# EAGLE design ARM-LPC1115_V0.09 (EAGLE 6.4)
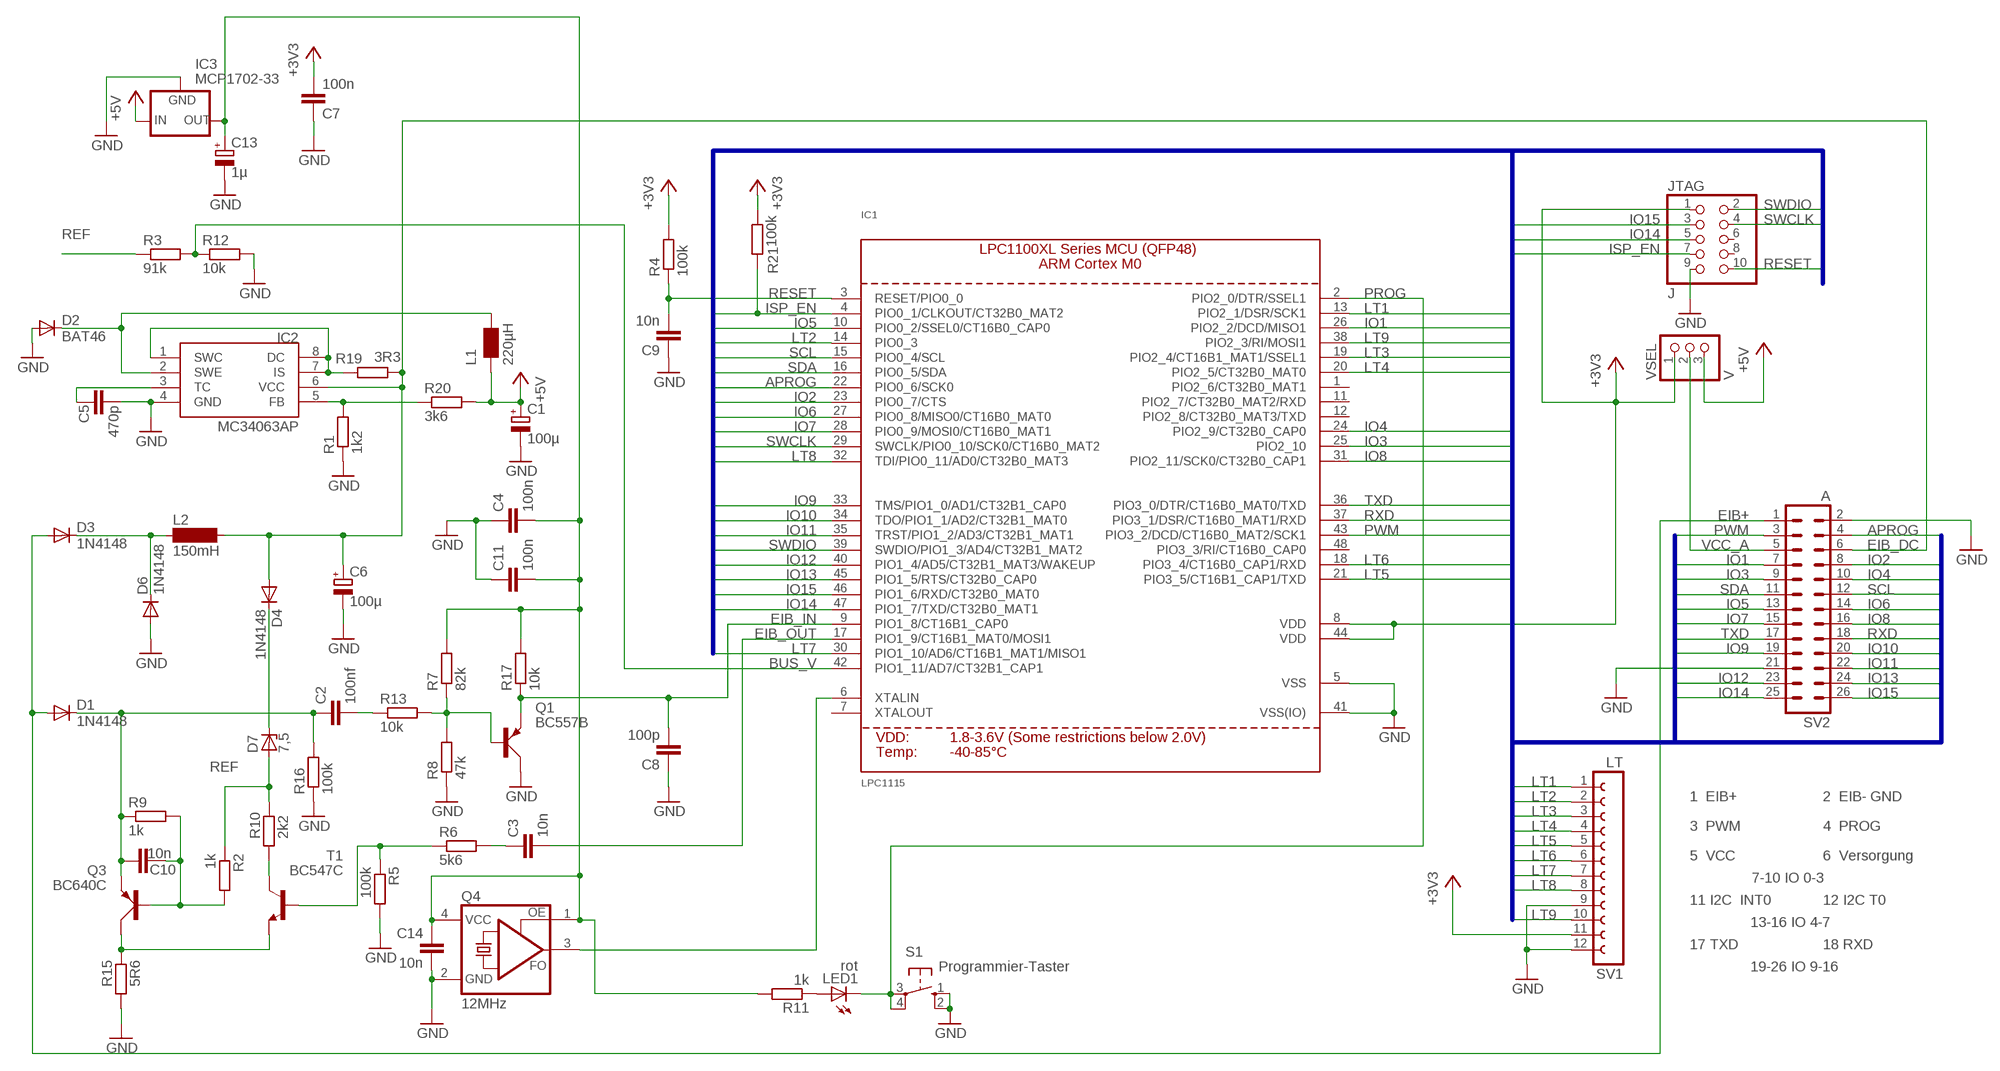
[diagram p0: schematic, sheet 1]

## Parts
C1  100µ  CPOL-EUE5-8.5  [E5-8,5]
C2  100nf  C-EU050-024X044  [C050-024X044]
C3  10n  C-EU050-024X044  [C050-024X044]
C4  100n  C-EU025-024X044  [C025-024X044]
C5  470p  C-EU025-024X044  [C025-024X044]
C6  100µ  CPOL-EUE5-8.5  [E5-8,5]
C7  100n  C-EU050-024X044  [C050-024X044]
C8  100p  C-EU050-024X044  [C050-024X044]
C9  10n  C-EU050-024X044  [C050-024X044]
C10  10n  C-EU050-024X044  [C050-024X044]
C11  100n  C-EU025-024X044  [C025-024X044]
C13  1µ  CPOL-EUE2-4  [E2-4]
C14  10n  C-EUC1206  [C1206]
D1  1N4148  DIODE-D-5  [D-5]
D2  BAT46  DIODE-C1702-05  [C1702-05]
D3  1N4148  DIODE-D-2.5  [D-2.5]
D4  1N4148  DIODE-D-5  [D-5]
D6  1N4148  DIODE-D-2.5  [D-2.5]
D7  7,5  ZENER-DIODEZD-7.5  [ZDIO-7.5]
IC1  LPC1115  LPC1113/4/5_QFP48_XLSERIES  [LQFP48]
IC2  MC34063AP  [DIL08]
IC3  MCP1702-33  79LXX  [79LXX]
JTAG  J  PINHD-2X05_2.00  [2X05M]
L1  220µH  L_R85  [L_RAD_D8RM5]
L2  150mH  SD12-1000  [SD12_1000]
LED1  rot  LED3MM  [LED3MM]
Q1  BC557B  BC557  [SOT54A]
Q3  BC640C  BC640  [SOT54D]
Q4  12MHz  ASFL  [ASF]
R1  1k2  R-EU_0207/10  [0207/10]
R2  1k  R-EU_0204/7  [0204/7]
R3  91k  R-EU_0204/7  [0204/7]
R4  100k  R-EU_0204/7  [0204/7]
R5  100k  R-EU_0207/10  [0207/10]
R6  5k6  R-EU_0204/7  [0204/7]
R7  82k  R-EU_0207/7  [0207/7]
R8  47k  R-EU_0207/7  [0207/7]
R9  1k  R-EU_0204/7  [0204/7]
R10  2k2  R-EU_0204/7  [0204/7]
R11  1k  R-EU_0207/7  [0207/7]
R12  10k  R-EU_0204/7  [0204/7]
R13  10k  R-EU_0207/7  [0207/7]
R15  5R6  R-EU_0207/10  [0207/10]
R16  100k  R-EU_0207/7  [0207/7]
R17  10k  R-EU_0207/7  [0207/7]
R19  3R3  R-EU_0207/10  [0207/10]
R20  3k6  R-EU_0207/10  [0207/10]
R21  100k  R-EU_0204/7  [0204/7]
S1  Programmier-Taster  10-XX  [B3F-10XX]
SV1  LT  FE12-1  [FE12]
SV2  A  ML26  [ML26]
T1  BC547C  BC547  [TO92]
VSEL  V  HEADER-1X3ROUND  [1X03_ROUND]

## Nets
APROG: IC1.22(PIO0_6/SCK0) SV2.4
BUS_V: IC1.42(PIO1_11/AD7/CT32B1_CAP1) R3.2 R12.1
DRAIN: C2.1 C10.1 D1.C Q3.E R9.1 R16.2
EIB+: D1.A D3.A SV2.1
EIB_DC: C6.+ D4.A IC2.6(VCC) L2.2 R19.2 SV2.6
EIB_IN: C8.2 IC1.9(PIO1_8/CT16B1_CAP0) Q1.E R17.1
EIB_OUT: C3.2 IC1.17(PIO1_9/CT16B1_MAT0/MOSI1)
GND: C1.- C4.1 C5.2 C6.- C7.1 C8.1 C9.1 C11.1 C13.- C14.2 D2.A D6.A IC1.5(VSS) IC1.41(VSS(IO)) IC2.4(GND) IC3.GND JTAG.9 Q1.C Q4.2(GND) R1.1 R5.2 R8.1 R12.2 R15.1 R16.1 S1.1(S) S1.2(S1) SV1.9 SV1.12 SV2.2 SV2.21
IO1: IC1.26(PIO2_2/DCD/MISO1) SV2.7
IO2: IC1.23(PIO0_7/CTS) SV2.8
IO3: IC1.25(PIO2_10) SV2.9
IO4: IC1.24(PIO2_9/CT32B0_CAP0) SV2.10
IO5: IC1.10(PIO0_2/SSEL0/CT16B0_CAP0) SV2.13
IO6: IC1.27(PIO0_8/MISO0/CT16B0_MAT0) SV2.14
IO7: IC1.28(PIO0_9/MOSI0/CT16B0_MAT1) SV2.15
IO8: IC1.31(PIO2_11/SCK0/CT32B0_CAP1) SV2.16
IO9: IC1.33(TMS/PIO1_0/AD1/CT32B1_CAP0) SV2.19
IO10: IC1.34(TDO/PIO1_1/AD2/CT32B1_MAT0) SV2.20
IO11: IC1.35(TRST/PIO1_2/AD3/CT32B1_MAT1) SV2.22
IO12: IC1.40(PIO1_4/AD5/CT32B1_MAT3/WAKEUP) SV2.23
IO13: IC1.45(PIO1_5/RTS/CT32B0_CAP0) SV2.24
IO14: IC1.47(PIO1_7/TXD/CT32B0_MAT1) JTAG.5 SV2.25
IO15: IC1.46(PIO1_6/RXD/CT32B0_MAT0) JTAG.3 SV2.26
ISP_EN: IC1.4(PIO0_1/CLKOUT/CT32B0_MAT2) JTAG.7 R21.1
LT1: IC1.13(PIO2_1/DSR/SCK1) SV1.1
LT2: IC1.14(PIO0_3) SV1.2
LT3: IC1.19(PIO2_4/CT16B1_MAT1/SSEL1) SV1.3
LT4: IC1.20(PIO2_5/CT32B0_MAT0) SV1.4
LT5: IC1.21(PIO3_5/CT16B1_CAP1/TXD) SV1.5
LT6: IC1.18(PIO3_4/CT16B0_CAP1/RXD) SV1.6
LT7: IC1.30(PIO1_10/AD6/CT16B1_MAT1/MISO1) SV1.7
LT8: IC1.32(TDI/PIO0_11/AD0/CT32B0_MAT3) SV1.8
LT9: IC1.38(PIO2_3/RI/MOSI1) SV1.10
N$1: C3.1 R6.2
N$2: C2.2 R13.1
N$3: IC2.5(FB) R1.2 R20.1
N$4: IC2.1(SWC) IC2.7(IS) IC2.8(DC) R19.1
N$6: R10.1 T1.3(C)
N$7: Q3.C R15.2 T1.1(E)
N$8: D3.C D6.C L2.1
N$9: D4.C D7.C
N$10: D2.C IC2.2(SWE) L1.1
N$12: R5.1 R6.1 T1.2(B)
N$13: C5.1 IC2.3(TC)
N$14: Q1.B R7.1 R8.2 R13.2
N$15: C10.2 Q3.B R2.2 R9.2
N$17: IC1.6(XTALIN) Q4.3(FO)
N$41: LED1.A R11.1
PROG: IC1.2(PIO2_0/DTR/SSEL1) LED1.K(C) S1.3(P) S1.4(P1)
PWM: IC1.43(PIO3_2/DCD/CT16B0_MAT2/SCK1) SV2.3
REF: D7.A R2.1 R3.1 R10.2
RESET: C9.2 IC1.3(RESET/PIO0_0) JTAG.10 R4.1
RXD: IC1.37(PIO3_1/DSR/CT16B0_MAT1/RXD) SV2.18
SCL: IC1.15(PIO0_4/SCL) SV2.12
SDA: IC1.16(PIO0_5/SDA) SV2.11
SWCLK: IC1.29(SWCLK/PIO0_10/SCK0/CT16B0_MAT2) JTAG.4
SWDIO: IC1.39(SWDIO/PIO1_3/AD4/CT32B1_MAT2) JTAG.2
TXD: IC1.36(PIO3_0/DTR/CT16B0_MAT0/TXD) SV2.17
VCC_3V3: C4.2 C7.2 C11.2 C13.+ C14.1 IC1.8(VDD) IC1.44(VDD) IC3.OUT JTAG.1 Q4.1(OE) Q4.4(VCC) R4.2 R7.2 R11.2 R17.2 R21.2 SV1.11 VSEL.1 ; supply symbol labelled +3V3
VCC_5V: C1.+ IC3.IN L1.2 R20.2 VSEL.3 ; supply symbol labelled +5V
VCC_A: SV2.5 VSEL.2
Unconnected: IC1.1(PIO2_6/CT32B0_MAT1) IC1.7(XTALOUT) IC1.11(PIO2_7/CT32B0_MAT2/RXD) IC1.12(PIO2_8/CT32B0_MAT3/TXD) IC1.48(PIO3_3/RI/CT16B0_CAP0) JTAG.6 JTAG.8

## Buses
IO[1..15],LT[1..9],SCL,SDA,PWM,APROG,RXD,TXD,RESET,SWCLK,SWDIO,ISP_EN

## Notes on the sheet
- 1  EIB+ | 2  EIB- GND
- 3  PWM | 4  PROG
- 5  VCC | 6  Versorgung
- 7-10 IO 0-3
- 11 I2C  INT0 | 12 I2C T0
- 13-16 IO 4-7
- 17 TXD | 18 RXD
- 19-26 IO 9-16

## Library data of the parts
C1 C6 C13 = rcl:CPOL-EU: POLARIZED CAPACITOR, European symbol
C2-C5 C7-C11 C14 = rcl:C-EU: CAPACITOR, European symbol
D1-D4 D6 = diode:DIODE-: DIODE
D7 = diode:ZENER-DIODE: Z-Diode
IC1 = microbuilder:LPC1113/4/5_QFP48_XLSERIES: LPC1113/4/5 ARM Cortex M0 MCU (50MHz) - XL Series (FBD48/3x3) LPC1115FBD48/303: Max Frequency: 50MHz Flash: 64kB SRAM: 8kB ADC: 10-bit
IC2 = mc34063:MC34063
IC3 = v-reg:79LXX: VOLTAGE REGULATOR
JTAG = pinhead-2:PINHD-2X05: PIN HEADER
L1 = fbctrls1:L
L2 = inductor-neosid:SD12: INDUCTOR nominal inductance
LED1 = led:LED: LED OSRAM: - CHIPLED LG R971, LG N971, LY N971, LG Q971, LY Q971, LO R971, LY R971 LH N974, LH R974 LS Q976, LO Q976, LY Q976 LO Q996 - Hyper CHIPLED LW Q18S LB Q993, LB Q99A, LB R99A - SideLED LS A670, LO A670, LY A670, LG A670, LP A670 LB A673, LV A673, LT A673, LW A673 LH A674 LY A675 LS A676, LA A676, LO A676, LY A676, LW A676 LS A679, LY A679, LG A679 - Hyper Micro SIDELED® LS Y876, LA Y876, LO Y876, LY Y876 LT Y87S - SmartLED LW L88C, LW L88S LB L89C, LB L89S, LG L890 LS L89K, LO L89K, LY L89K LS L896, LA L896, LO L896, LY L896 - TOPLED LS T670, LO T670, LY T670, LG T670, LP T670 LSG T670, LSP T670, LSY T670, LOP T670, LYG T670 LG T671, LOG T671, LSG T671 LB T673, LV T673, LT T673, LW T673 LH T674 LS T676, LA T676, LO T676, LY T676, LB T676, LH T676, LSB T676, LW T676 LB T67C, LV T67C, LT T67C, LS T67K, LO T67K, LY T67K, LW E67C LS E67B, LA E67B, LO E67B, LY E67B, LB E67C, LV E67C, LT E67C LW T67C LS T679, LY T679, LG T679 LS T770, LO T770, LY T770, LG T770, LP T770 LB T773, LV T773, LT T773, LW T773 LH T774 LS E675, LA E675, LY E675, LS T675 LS T776, LA T776, LO T776, LY T776, LB T776 LHGB T686 LT T68C, LB T68C - Hyper Mini TOPLED® LB M676 - Mini TOPLED Santana® LG M470 LS M47K, LO M47K, LY M47K Source: http://www.osram.convergy.de - LUMILED® LXK2-PW12-R00, LXK2-PW12-S00, LXK2-PW14-U00, LXK2-PW14-V00 LXK2-PM12-R00, LXK2-PM12-S00, LXK2-PM14-U00 LXK2-PE12-Q00, LXK2-PE12-R00, LXK2-PE12-S00, LXK2-PE14-T00, LXK2-PE14-U00 LXK2-PB12-K00, LXK2-PB12-L00, LXK2-PB12-M00, LXK2-PB14-N00, LXK2-PB14-P00, LXK2-PB14-Q00 LXK2-PR12-L00, LXK2-PR12-M00, LXK2-PR14-Q00, LXK2-PR14-R00 LXK2-PD12-Q00, LXK2-PD12-R00, LXK2-PD12-S00 LXK2-PH12-R00, LXK2-PH12-S00 LXK2-PL12-P00, LXK2-PL12-Q00, LXK2-PL12-R00 Source: www.luxeon.com
Q1 = transistor-small-signal:BC557: PNP TRANSISTOR
Q3 = transistor-small-signal:BC640: PNP TRANSISTOR
Q4 = crystal:ASF*: CRYSTAL CLOCK OSCILLATORS 5.0 Vdc or 3.3 Vdc - LOW PROFILE ULTRA MINIATURE CERAMIC SURFACE MOUNT Source: http://www.abracon.com/Oscillators/asf1-L-L1.pdf
R1-R13 R15-R17 R19-R21 = rcl:R-EU_: RESISTOR, European symbol
S1 = switch-omron:10-XX: OMRON SWITCH
SV1 = con-lsta:FE12-1: FEMALE HEADER; OC_FARNELL: unknown; OC_NEWARK: unknown
SV2 = con-harting-ml:ML26: HARTING; OC_FARNELL: unknown; OC_NEWARK: unknown
T1 = transistor:BC547: NPN TRANSISTOR
VSEL = microbuilder:HEADER-1X3: PIN HEADER

## Board
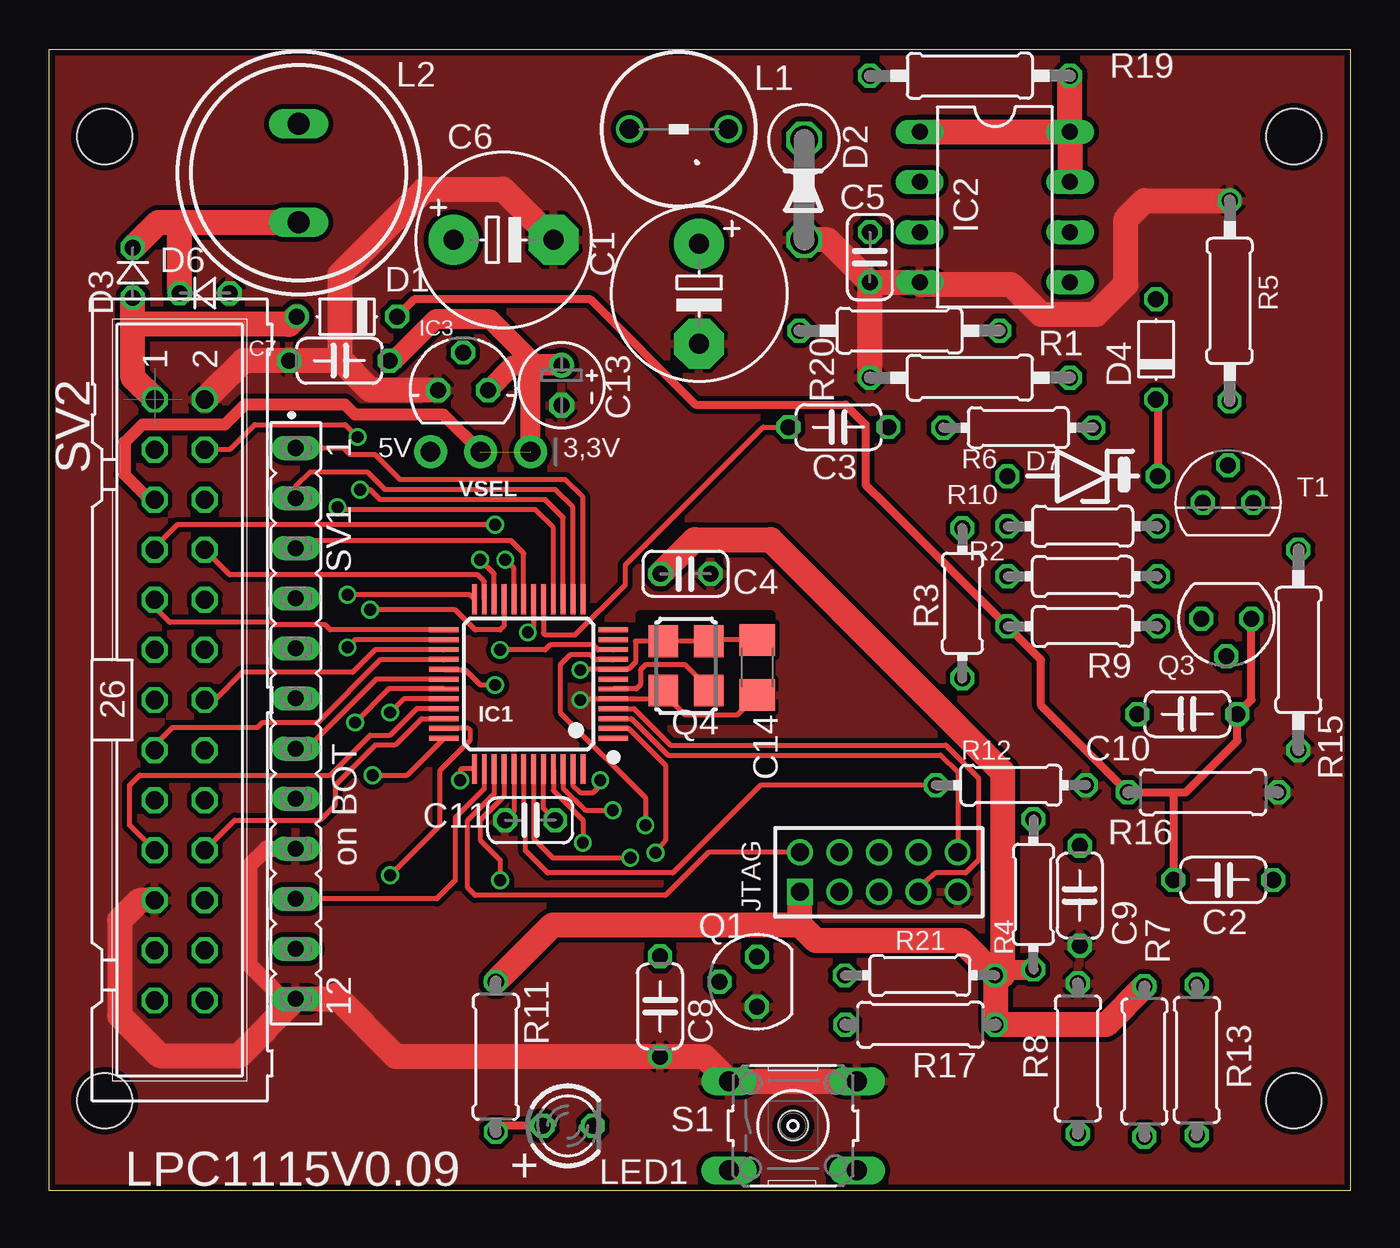
[diagram p1: board, top side]
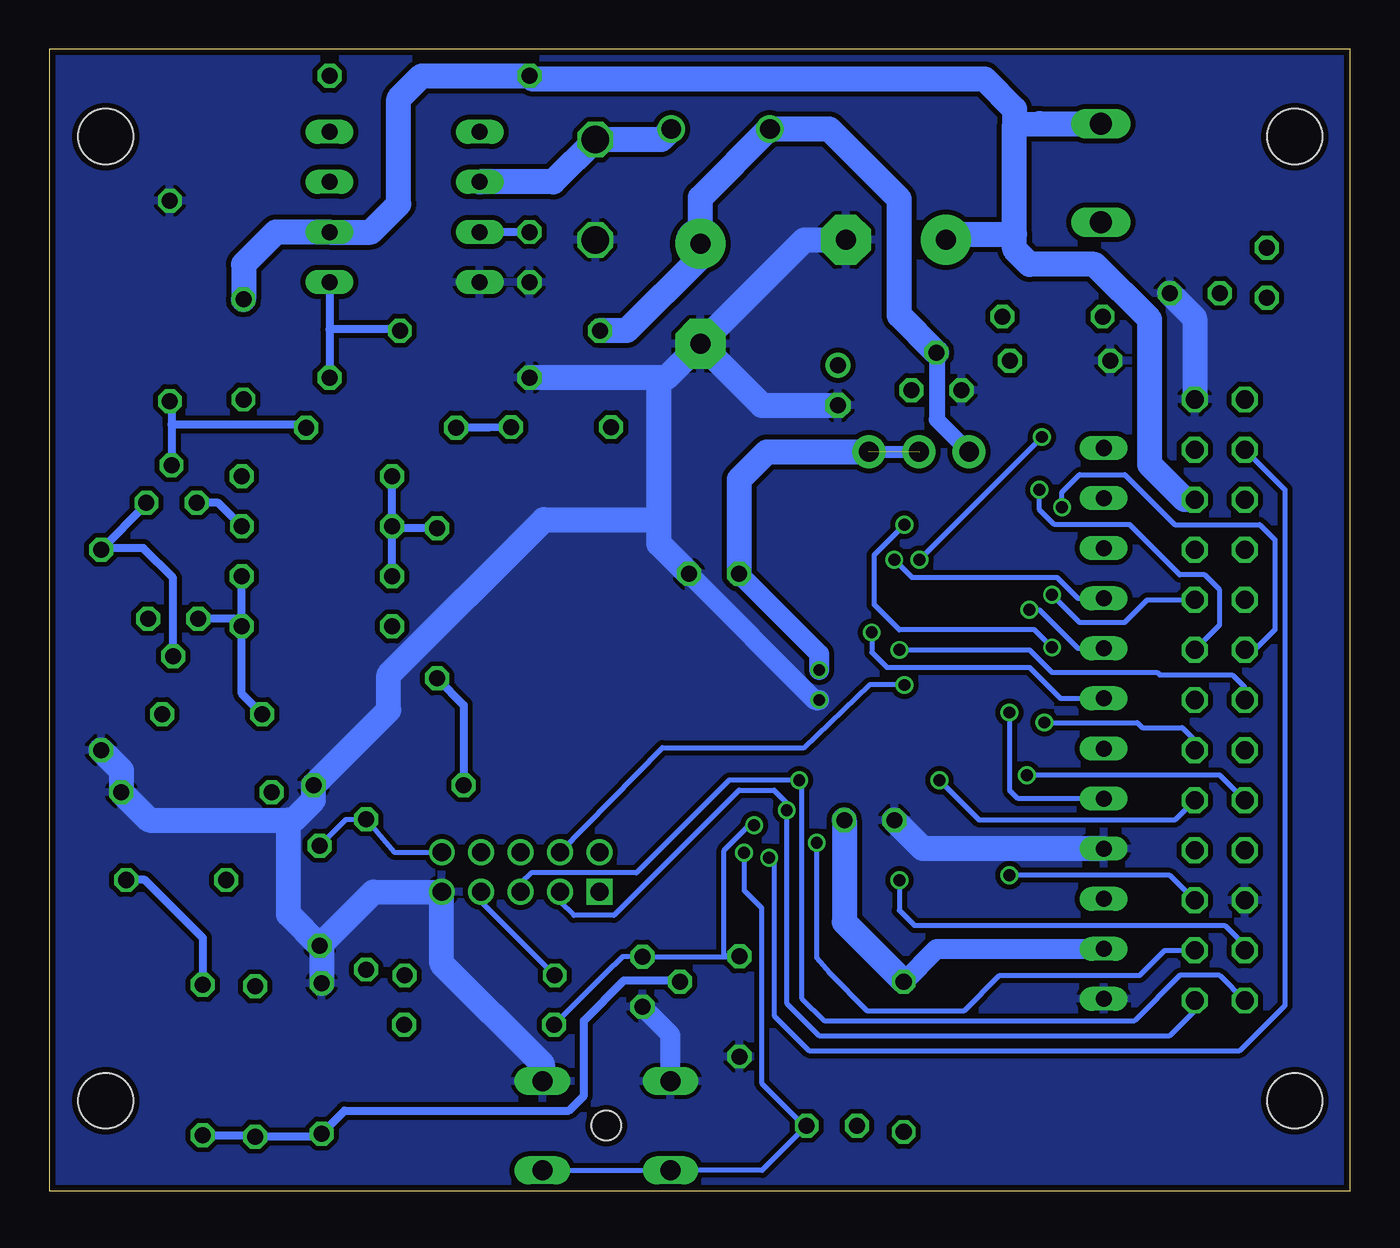
[diagram p2: board, bottom side, seen from below]

Size 66 x 57.9 mm. Coordinates in mm from the lower left corner, seen from the top.
Outline: 0,57.9 66,57.9 66,0 0,0 0,57.9
Copper layers (1*16): Top 0.035mm / dielectric 1.5mm / Bottom 0.035mm
Design rules "PCB-POOL Standard *": minimum track width 0.15mm, minimum drill 0.3mm, track to track 0.15mm, track to pad 0.15mm, pad to pad 0.15mm, via to via 0.15mm, smd to smd 0.15mm, copper to edge 0.3mm, drill to drill 0.2mm, minimum pad ring 0.2mm, minimum via ring 0.15mm, stop-mask expansion 0.075mm, vias tented up to drill 0mil, thermal gap 0.2mm
Holes 2.8 mm at 2.81,53.48 63.14,53.48 63.14,4.58 2.81,4.58
Holes 1.5 mm at 37.73,3.31
tRestrict: area 30,23.9 to 36.6,29.2

### Footprints (pad centres in the part's own frame; a part is rotated, then mirrored left to right if it is on the bottom)
E5-8,5 = drill 1.016 pad 2.54: + -2.54,0 | drill 1.016 pad 2.54 octagon: - 2.54,0
C050-024X044 = drill 0.813 octagon: 1 -2.54,0; 2 2.54,0
C025-024X044 = drill 0.813 octagon: 1 -1.27,0; 2 1.27,0
E2-4 = drill 0.813 pad 1.27: + -1.016,0 | drill 0.813 pad 1.27 octagon: - 1.016,0
C1206 = smd 1.6 x 1.8: 1 -1.4,0; 2 1.4,0
D-5 = drill 0.813 octagon: A 2.54,0; C -2.54,0
C1702-05 = drill 1.397 octagon: A 2.54,0; C -2.54,0
D-2.5 = drill 0.813 octagon: A 1.27,0; C -1.27,0
ZDIO-7.5 = drill 0.813 octagon: A 3.81,0; C -3.81,0
LQFP48 = smd 1.5 x 0.25: 1 -4.3,2.75; 2 -4.3,2.25; 3 -4.3,1.75; 4 -4.3,1.25; 5 -4.3,0.75; 6 -4.3,0.25; 7 -4.3,-0.25; 8 -4.3,-0.75; 9 -4.3,-1.25; 10 -4.3,-1.75; 11 -4.3,-2.25; 12 -4.3,-2.75; 25 4.3,-2.75; 26 4.3,-2.25; 27 4.3,-1.75; 28 4.3,-1.25; 29 4.3,-0.75; 30 4.3,-0.25; 31 4.3,0.25; 32 4.3,0.75; 33 4.3,1.25; 34 4.3,1.75; 35 4.3,2.25; 36 4.3,2.75 | smd 0.25 x 1.5: 13 -2.75,-4.3; 14 -2.25,-4.3; 15 -1.75,-4.3; 16 -1.25,-4.3; 17 -0.75,-4.3; 18 -0.25,-4.3; 19 0.25,-4.3; 20 0.75,-4.3; 21 1.25,-4.3; 22 1.75,-4.3; 23 2.25,-4.3; 24 2.75,-4.3; 37 2.75,4.3; 38 2.25,4.3; 39 1.75,4.3; 40 1.25,4.3; 41 0.75,4.3; 42 0.25,4.3; 43 -0.25,4.3; 44 -0.75,4.3; 45 -1.25,4.3; 46 -1.75,4.3; 47 -2.25,4.3; 48 -2.75,4.3
DIL08 = drill 0.813 long: 1 -3.81,-3.81; 2 -1.27,-3.81; 3 1.27,-3.81; 4 3.81,-3.81; 5 3.81,3.81; 6 1.27,3.81; 7 -1.27,3.81; 8 -3.81,3.81
79LXX = drill 0.813 octagon: GND -1.27,0; IN 0,1.905; OUT 1.27,0
2X05M = drill 0.914 square: 1 -4,-1 | drill 0.914: 2 -4,1; 3 -2,-1; 4 -2,1; 5 0,-1; 6 0,1; 7 2,-1; 8 2,1; 9 4,-1; 10 4,1
L_RAD_D8RM5 = drill 1: 1 -2.5,0; 2 2.5,0
SD12_1000 = drill 1.1 long: 1 -2.5,0; 2 2.5,0
LED3MM = drill 0.813 octagon: A -1.27,0; K 1.27,0
SOT54A = drill 0.813 octagon: B 0,1.905; C -1.27,0; E 1.27,0
SOT54D = drill 0.813 octagon: B 1.27,0; C 0,1.905; E -1.27,0
ASF = smd 1.6 x 1.5: 1 -1.25,-1.15; 2 1.25,-1.15; 3 1.25,1.15; 4 -1.25,1.15
0207/10 = drill 0.813 octagon: 1 -5.08,0; 2 5.08,0
0204/7 = drill 0.813 octagon: 1 -3.81,0; 2 3.81,0
0207/7 = drill 0.813 octagon: 1 -3.81,0; 2 3.81,0
B3F-10XX = drill 1.016 long: 1 -3.251,2.261; 2 3.251,2.261; 3 -3.251,-2.261; 4 3.251,-2.261
FE12 = drill 0.813 long: 1 -13.97,0; 2 -11.43,0; 3 -8.89,0; 4 -6.35,0; 5 -3.81,0; 6 -1.27,0; 7 1.27,0; 8 3.81,0; 9 6.35,0; 10 8.89,0; 11 11.43,0; 12 13.97,0
ML26 = drill 0.914 octagon: 1 -15.24,-1.27; 2 -15.24,1.27; 3 -12.7,-1.27; 4 -12.7,1.27; 5 -10.16,-1.27; 6 -10.16,1.27; 7 -7.62,-1.27; 8 -7.62,1.27; 9 -5.08,-1.27; 10 -5.08,1.27; 11 -2.54,-1.27; 12 -2.54,1.27; 13 0,-1.27; 14 0,1.27; 15 2.54,-1.27; 16 2.54,1.27; 17 5.08,-1.27; 18 5.08,1.27; 19 7.62,-1.27; 20 7.62,1.27; 21 10.16,-1.27; 22 10.16,1.27; 23 12.7,-1.27; 24 12.7,1.27; 25 15.24,-1.27; 26 15.24,1.27
TO92 = drill 0.813 octagon: 1 1.27,0; 2 0,1.905; 3 -1.27,0
1X03_ROUND = drill 1 pad 1.676: 1 -2.54,0; 2 0,0; 3 2.54,0

### Placement (x,y rotation side)
C1  32.97,45.5 270 top
C2  59.56,15.77 0 top
C3  40.04,38.74 180 top
C4  32.27,31.3 180 top
C5  41.62,47.36 270 top
C6  23.05,48.24 0 top
C7  14.72,42.11 0 top
C8  30.99,9.36 90 top
C9  52.28,14.98 90 top
C10  57.74,24.19 180 top
C11  24.4,18.8 0 top
C13  25.99,40.85 270 top
C14  35.91,26.55 270 top
D1  15.1,44.35 180 top
D2  38.29,50.78 270 top
D3  4.24,46.57 270 top
D4  56.15,42.68 90 top
D6  7.89,45.54 0 top
D7  52.42,36.25 180 top
IC1  24.32,25.71 180 top
IC2  47.97,49.9 270 top
IC3  20.99,40.62 0 top
JTAG  42.08,16.17 0 top
L1  31.94,53.85 180 top
L2  12.65,51.63 90 top
LED1  26.3,3.31 0 top
Q1  35.91,10.61 90 top
Q3  59.72,29.03 180 top
Q4  32.31,26.63 270 top
R1  46.7,41.25 0 top
R2  52.42,31.17 0 top
R3  46.32,29.81 270 top
R4  49.93,15.04 270 top
R5  59.88,45.14 90 top
R6  49.16,38.71 180 top
R7  55.56,6.56 90 top
R8  52.18,6.72 270 top
R9  52.42,28.63 0 top
R10  52.42,33.71 180 top
R11  22.65,6.8 90 top
R12  48.78,20.58 0 top
R13  58.21,6.64 270 top
R15  63.37,27.44 90 top
R16  58.53,20.22 180 top
R17  44.2,8.44 0 top
R19  46.7,56.55 180 top
R20  43.13,43.63 180 top
R21  44.16,10.93 0 top
S1  37.73,3.31 0 top
SV1  12.51,23.71 270 top
SV2  6.62,24.9 270 top
T1  59.8,34.9 0 top
VSEL  21.88,37.49 180 top

### Tracks (layer width: path | path; a pad name or v marks a point on that pad's centre or on a via)
APROG  (via drill 0.6)
  Top 0.254: IC1.22 22.57,31.3 v21.86,32.01 | v15.64,38.23 15,38.87 10.43,38.87 9.16,37.6 SV2.4
  Bottom 0.254: v21.86,32.01 v15.64,38.23
BUS_V
  Top 0.254: IC1.42 24.07,19.64 24.15,19.57 24.15,17.28 25.29,16.14 31.64,16.14 36.08,20.58 R12.1
  Bottom 0.406: R3.2 44.97,24.65 R12.1
DRAIN
  Top 0.406: 57.18,20.22 R16.2 53.86,21.07 53.86,21.09 50.31,24.65 50.31,26.93 R9.1 42.43,34.81 | 57.18,20.22 57.66,20.22 60.28,22.84 C10.1 60.99,24.9 Q3.E | C2.1 57.02,20.06 57.18,20.22 | D1.C 18.51,45.22 27.45,45.22 32.78,39.89 40.4,39.89 41.42,38.87 41.42,35.82 42.43,34.81 | 42.43,34.81
  Bottom 0.406: R16.2
EIB+
  Top 1.27: SV2.1 4.24,41.25 4.24,43.95 | 4.24,43.95 D3.A | D1.A 12.16,43.95 4.24,43.95
EIB_DC
  Bottom 1.27: D4.A 56.15,47 54.52,48.63 IC2.6 49.69,48.63 48.28,50.05 48.28,55.38 47.11,56.55 R19.2 41.47,56.4 18.56,56.4 17.03,54.87 17.03,54.11 | SV2.6 8.4,35.06 10.18,36.84 10.18,44.2 12.97,47 16.27,47 17.03,47.76 17.03,48.52 | 17.03,48.52 17.03,54.11 | 17.03,54.11 15.75,54.13 L2.2 | C6.+ 20.23,48.52 17.03,48.52
EIB_IN  (via drill 0.6)
  Top 0.254: IC1.9 28.59,26.93 27.7,26.93 27.45,27.19 26.43,27.19 25.92,26.68 25.92,24.27 30.24,19.95 v30.24,18.55
  Bottom 0.254: R17.1 37.39,11.44 37.35,11.44 36.91,11.88 Q1.E 31,11.88 C8.2 30.99,11.93 31.77,11.95 31.77,17.28 30.24,18.8 v30.24,18.55
EIB_OUT
  Top 0.254: IC1.17 25.07,28.29 25.16,28.2 26.69,28.2 29.23,30.74 29.23,31.76 36.21,38.74 C3.2
GND  (via drill 0.6)
  Top 0.254: C14.2 34.9,24.14 32.27,24.14 31.03,25.38 Q4.2 arc-90 30.73,24.96 IC1.5 27,24.96 v26.94,24.9 | IC1.41 23.57,19.25 C11.1
  Top 0.61: IC2.4 44.21,46.05 44.21,45.98
  Top 0.813: SV1.12 11.88,9.74 10.18,11.44 10.18,16.52 11.02,17.36 SV1.9
  Top 1.016: 14.75,42.17 14.69,42.11 | 14.32,9.74 14.49,9.91
  Top 1.27: C5.2 IC2.4 | R1.1 C5.2 | 44.21,45.98 48.78,45.98 50.31,44.46 53.1,44.46 54.63,45.98 54.63,49.28 55.56,50.22 R5.2 | C5.2 39.48,48.24 D2.A | IC3.GND 16.3,40.62 14.75,42.17 14.75,46.49 19.07,50.81 23.02,50.81 C6.- | S1.2 S1.1 33.24,6.82 C8.1 17.59,6.82 14.49,9.91 | 14.69,42.11 C7.1 9.86,42.11 SV2.2 | 14.32,9.74 SV1.12 9.64,6.87 5.6,6.87 3.57,8.9 3.57,13.72 4.59,14.74 SV2.21
  Bottom 0.406: C9.1 52.18,12.34
  Bottom 1.016: S1.1 34.48,7.92 Q1.C | C4.1 27.15,24.9 v26.94,24.9
  Bottom 1.27: 52.18,12.34 R8.1 | R15.1 62.34,21.33 R16.1 60.93,18.8 53.86,18.8 | S1.2 40.99,6.43 46.09,11.53 JTAG.9 49.56,15.15 C9.1 53.86,14.03 53.86,18.8 | C1.- 27.7,48.24 C6.- | D6.A 7.89,44.27 SV2.2 | C1.- 34.68,41.25 35.07,41.25 | 35.07,41.25 R1.1 | 53.86,18.8 53.61,18.8 52.59,19.82 R12.2 48.78,24.39 48.78,26.17 40.91,34.04 35.07,34.04 | C4.1 35.07,32.82 35.07,34.04 | 35.07,34.04 35.07,41.25 | C1.- 29.85,39.84 C13.- | SV1.9 21.68,17.36 C11.1
  pour Bottom (isolate 0.254): -1.16,-0.5 -1,58.55 66.94,58.55 66.94,-0.5
  pour Top (isolate 0.254): -1.16,58.87 -1.16,-0.82 67.26,-0.82 67.26,58.71 -0.68,58.71
IO1  (via drill 0.6)
  Top 0.254: v22.62,33.79 6.49,33.79 5.35,32.65 SV2.7 | IC1.26 20.01,27.95 15.51,27.95 v15.13,27.57
  Bottom 0.254: v15.13,27.57 16.02,28.46 22.88,28.46 24.15,29.73 24.15,32.27 v22.62,33.79
IO2
  Top 0.254: IC1.23 22.07,30.91 21.73,31.25 9.16,31.25 SV2.8
IO3
  Top 0.254: SV2.9 5.35,29.6 6.11,28.84 11.32,28.84 11.45,28.71 13.99,28.71 14.24,28.46 IC1.25
IO4  (via drill 0.6)
  Top 0.254: IC1.24 21.35,30.23 v15.13,30.23
  Bottom 0.254: v15.13,30.23 13.73,28.84 11.45,28.84 10.3,29.98 SV2.10
IO5  (via drill 0.6)
  Top 0.254: IC1.10 28.6,27.44 27.83,27.44 27.57,27.69 25.42,27.69 25.16,27.44 v22.88,27.44
  Bottom 0.254: v22.88,27.44 16.27,27.44 15.13,26.3 9.79,26.3 9.67,26.17 5.99,26.17 5.35,25.54 SV2.13
IO6
  Top 0.254: IC1.27 20,27.44 16.53,27.44 15.38,26.3 9.79,26.3 8.4,24.9 SV2.14
IO7
  Top 0.254: IC1.28 19.99,26.93 16.78,26.93 13.61,23.76 10.81,23.76 10.56,23.5 6.24,23.5 5.35,22.61 SV2.15
IO8  (via drill 0.6)
  Top 0.254: IC1.31 17.21,25.46 v15.51,23.76
  Bottom 0.254: v15.51,23.76 10.81,23.76 10.56,23.5 8.53,23.5 7.89,22.87 SV2.16
IO9
  Top 0.254: SV2.19 4.08,18.55 4.08,20.58 4.59,21.09 14.24,21.09 16.27,23.12 17.29,23.12 18.63,24.46 IC1.33
IO10
  Top 0.254: SV2.20 9.41,18.8 13.73,18.8 14.49,19.57 14.49,20.58 16.53,22.61 17.54,22.61 18.89,23.96 IC1.34
IO11  (via drill 0.6)
  Top 0.254: v17.29,16.01 19.83,18.55 19.83,21.34 21.35,22.87 21.35,23.38 21.27,23.46 IC1.35
  Bottom 0.254: SV2.22 9.16,16.01 v17.29,16.01
IO12  (via drill 0.6)
  Top 0.254: IC1.40 23.07,20.02 21.86,18.8 21.86,17.79 22.88,16.77 v22.88,15.76
  Bottom 0.254: v22.88,15.76 22.88,14.23 22.11,13.47 6.37,13.47 5.35,12.45 SV2.23
IO13  (via drill 0.6)
  Top 0.254: IC1.45 25.57,20.3 27.07,18.8 v27.07,17.66
  Bottom 0.254: v27.07,17.66 27.07,11.82 26.43,11.06 24.53,9.15 19.57,9.15 17.8,10.93 10.68,10.93 9.41,12.2 SV2.24
IO14  (via drill 0.6)
  Top 0.254: IC1.47 26.56,21.4 26.56,20.58 26.94,20.2 27.57,20.2 27.96,20.58 v27.96,20.84
  Bottom 0.254: JTAG.5 42.09,15.6 41.55,16.14 36.21,16.14 31.51,20.84 v27.96,20.84 27.83,20.71 27.83,9.79 26.69,8.64 10.94,8.64 8.65,10.93 6.62,10.93 SV2.25
IO15  (via drill 0.6)
  Top 0.254: IC1.46 26.07,20.43 27.19,19.31 v28.59,19.31
  Bottom 0.254: JTAG.3 40.09,14.68 39.39,13.98 37.35,13.98 31,20.33 29.23,20.33 28.59,19.69 v28.59,19.31 28.59,9.53 26.94,7.88 9.16,7.88 7.89,9.15 SV2.26
ISP_EN
  Top 0.254: IC1.4 29.67,24.46 31.51,22.61 45.48,22.61 47.13,20.96 47.13,16.77 46.5,16.14 44.97,16.14 44.09,15.38 JTAG.7
  Bottom 0.254: JTAG.7 44.09,14.66 R21.1
LT1
  Top 0.254: IC1.13 27.07,35.18 26.18,36.08 17.8,36.08 16.53,37.35 15.26,37.35 14.92,37.68 SV1.1 13.91,37.68
LT2
  Top 0.254: IC1.14 26.57,34.67 25.67,35.57 17.03,35.57 16.14,36.46 13.22,36.46 12.51,35.74 SV1.2
LT3
  Top 0.254: IC1.19 24.07,32.34 23.43,32.98 12.89,32.98 SV1.3
LT4  (via drill 0.6)
  Top 0.254: IC1.20 23.57,31.57 v23.13,32.01
  Bottom 0.254: v23.13,32.01 22.24,31.12 14.88,31.12 13.81,30.06 SV1.4
LT5  (via drill 0.6)
  Top 0.254: IC1.21 23.07,28.65 22.88,28.46 21.61,28.46 20.59,29.47 v16.27,29.47
  Bottom 0.254: v16.27,29.47 15.76,29.47 13.81,27.52 SV1.5
LT6  (via drill 0.6)
  Top 0.254: IC1.18 24.57,28.63 v24.27,28.33
  Bottom 0.254: v24.27,28.33 24.27,27.31 23.51,26.55 16.27,26.55 14.7,24.98 SV1.6
LT7
  Top 0.254: IC1.30 16.57,25.96 13.05,22.44 SV1.7
LT8  (via drill 0.6)
  Top 0.254: IC1.32 17.98,24.96 v17.29,24.27
  Bottom 0.254: SV1.8 16.86,19.9 17.29,20.33 v17.29,24.27
LT9
  Top 0.254: IC1.38 22.07,20.41 20.59,18.93 20.59,15.76 19.65,14.82 SV1.10
N$1
  Bottom 0.406: C3.1 43.69,38.71 R6.2
N$2
  Bottom 0.406: C2.2 61.15,15.77 58.21,12.84 R13.1 | C2.2
N$3
  Bottom 0.406: IC2.5 51.78,43.7 | 51.78,43.7 R1.2 | R20.1 48.28,43.7 51.78,43.7
N$4
  Top 1.27: IC2.1 IC2.8 | IC2.8 IC2.7 | IC2.8 R19.1
N$6
  Bottom 0.406: T1.3 57.42,34.9 R10.1
N$7
  Bottom 0.406: T1.1 61.07,34.82 R15.2 63.29,32.6 61.23,32.6 59.72,31.09 Q3.C
N$8
  Top 1.016: D6.C
  Top 1.27: D3.C 5.53,49.13 6.62,49.13 | 6.62,49.13 L2.1 | D6.C 6.62,49.13
N$9
  Top 0.406: D4.C 56.23,40.06 D7.C
N$10
  Bottom 1.016: L1.1 34.44,53.83
  Bottom 1.27: IC2.2 40.43,51.17 D2.C 34.96,53.32 34.44,53.83
N$12
  Bottom 0.406: R5.1 59.8,39.98 59.8,38.87 | 59.8,38.87 T1.2 | R6.1 53.13,38.87 59.8,38.87
N$13
  Bottom 0.406: C5.1 IC2.3
N$14
  Bottom 0.406: R13.2 55.28,2.83 R7.1 52.34,2.75 R8.2 51.02,4.07 39.64,4.07 38.88,4.83 38.88,8.64 36.85,10.68 34.07,10.68 Q1.B
N$15
  Bottom 0.406: R2.2 R9.2 | Q3.B 56.63,29.03 R9.2 | R9.2 56.23,25.22 C10.2
N$17
  Top 0.254: Q4.3 33.46,25.5 32.27,26.68 30.24,26.68 29.99,26.42 29.99,25.66 29.79,25.46 IC1.6
N$41
  Top 0.406: LED1.A 22.97,3.31 R11.1
PROG  (via drill 0.6)
  Top 0.254: IC1.2 29.4,23.46 31.26,21.6 31.26,17.79 v30.75,17.15
  Bottom 0.254: S1.4 S1.3 29.84,1.05 LED1.K 27.7,3.31 29.86,5.47 29.86,14.36 30.75,15.25 v30.75,17.15
PWM  (via drill 0.6)
  Top 0.254: IC1.43 24.57,17.87 25.54,16.9 v29.48,16.9
  Bottom 0.254: SV2.3 3.32,35.57 3.32,9.41 5.6,7.12 27.45,7.12 29.23,8.9 29.23,16.64 v29.48,16.9
REF
  Bottom 0.406: R10.2 | R2.1 R10.2 | R2.1 | D7.A | R10.2 D7.A | 48.45,31.33 R2.1 | R3.1 48.51,33.62 R10.2
RESET
  Top 0.254: IC1.3 29.53,23.96 31.38,22.11 45.23,22.11 46.09,21.25 JTAG.10
  Bottom 0.254: C9.2 50.94,18.85 R4.1 48.51,17.18 JTAG.10
RXD  (via drill 0.6)
  Top 0.254: IC1.37 20.91,21.41 20.84,21.34 v20.84,20.84
  Bottom 0.254: SV2.18 8.91,18.8 18.81,18.8 v20.84,20.84
SCL  (via drill 0.6)
  Top 0.254: IC1.15 26.07,34.15 25.16,35.06 16.78,35.06 16.27,35.57 v15.76,35.57
  Bottom 0.254: SV2.12 6.62,28.71 6.62,30.49 7.38,31.25 8.65,31.25 11.19,33.79 15,33.79 15.76,34.55 v15.76,35.57
SDA  (via drill 0.6)
  Top 0.254: IC1.16 25.57,33.63 24.65,34.55 14.75,34.55 v14.62,34.68
  Bottom 0.254: SV2.11 4.84,27.44 3.83,28.46 3.83,33.03 4.59,33.79 8.91,33.79 11.45,36.33 13.73,36.33 14.62,35.44 v14.62,34.68
SWCLK  (via drill 0.6)
  Top 0.254: IC1.29 20.06,26.42 21.1,26.42 21.86,25.66 v22.62,25.66
  Bottom 0.254: JTAG.4 34.89,22.49 27.7,22.49 24.4,25.66 v22.62,25.66
SWDIO
  Top 0.254: IC1.39 22.57,20.15 21.23,18.8 21.23,15.38 21.61,14.99 31.26,14.99 33.43,17.17 JTAG.2
TXD  (via drill 0.6)
  Top 0.254: v16.4,21.09 18.15,21.09 IC1.36
  Bottom 0.254: SV2.17 6.62,21.09 v16.4,21.09
VCC_3V3  (via drill 0.6)  (1 unrouted)
  Top 0.254: C14.1 33.08,27.95 Q4.4 Q4.1 29.73,27.88 29.73,26.8 29.39,26.46 IC1.8 26.98,26.46 v26.94,26.42 | C11.2 25.07,19.4 IC1.44
  Top 0.61: C13.+ 25.94,41.92
  Top 1.016: 25.94,41.92 24.65,41.92 | 24.65,41.92 22.37,44.2 19.57,44.2 17.48,42.11 C7.2 | 47.97,10.98 R21.2 | R21.2 48.28,11.23 R4.2 | R21.2 48.01,10.9 | IC3.OUT 23.51,41.87 C13.+ | VSEL.1 24.42,41.92 24.65,41.92
  Top 1.27: 47.97,10.98 46.24,12.71 38.88,12.71 38.09,13.5 | 48.01,10.9 R17.2 53.63,8.44 R7.2 | 38.09,13.5 JTAG.1 | C4.2 32.73,33.03 36.59,33.03 48.35,21.27 48.35,10.93 R21.2 | R11.2 25.54,13.5 38.09,13.5
  Bottom 0.254: v26.94,26.42 27.15,26.42
  Bottom 0.406: 21.86,37.49 21.86,37.47
  Bottom 0.61: VSEL.1 21.86,37.49
  Bottom 1.016: R11.2 20.99,12.28 SV1.11 | C4.2 26.94,27.23 v26.94,26.42
  Bottom 1.27: VSEL.1 29.59,37.49 31,36.08 C4.2 | C11.2 25.67,13.63 R11.2
VCC_5V
  Bottom 0.61: R20.2
  Bottom 0.813: IC3.IN arc90 20.97,42.51 20.97,39.12 VSEL.3
  Bottom 1.016: 29.44,53.91 L1.2
  Bottom 1.27: 29.44,53.91 32.97,50.38 32.97,48.08 | C1.+ 32.97,47.36 36.7,43.63 R20.2 | IC3.IN 22.88,44.41 22.88,50.3 26.43,53.85 L1.2
  Bottom 2.54: C1.+ 32.97,48.08
VCC_A
  Top 0.61: VSEL.2 19.99,39.38 15.51,39.38 15,39.89 9.92,39.89 8.91,38.87 4.71,38.87 3.83,37.98 3.83,36.33 5.1,35.06 SV2.5

### Text on the board
tPlace: 5V | 3,3V | on BOT | +
tNames: LPC1115V0.09
tValues: auf Lötseite: